# EAGLE schematic PCB - alu40 - mupusb (EAGLE 9.6.2)
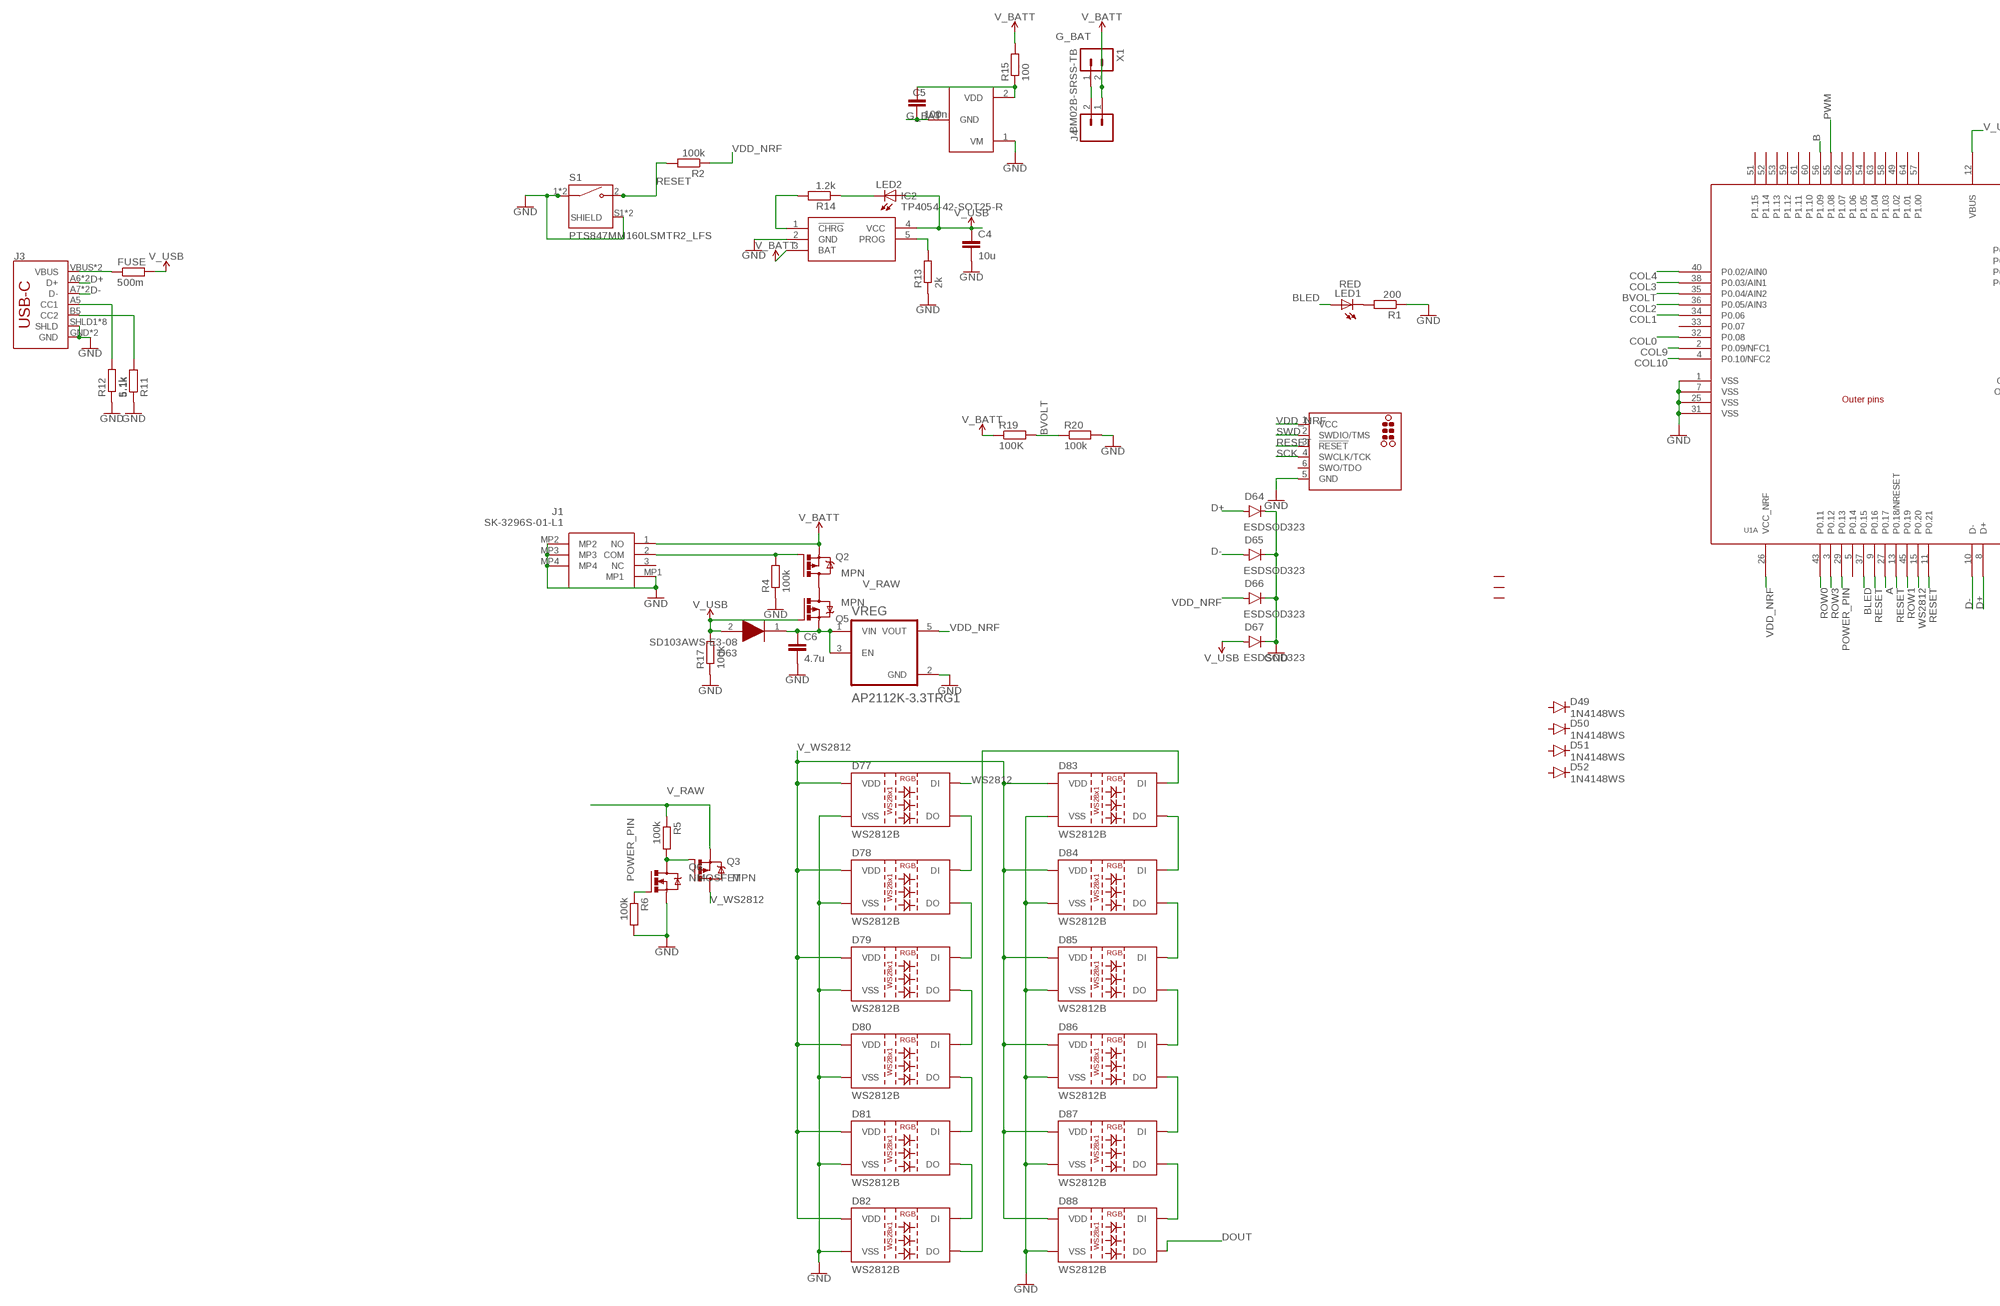
[diagram p0: schematic, sheet 1, part 1 of 2]
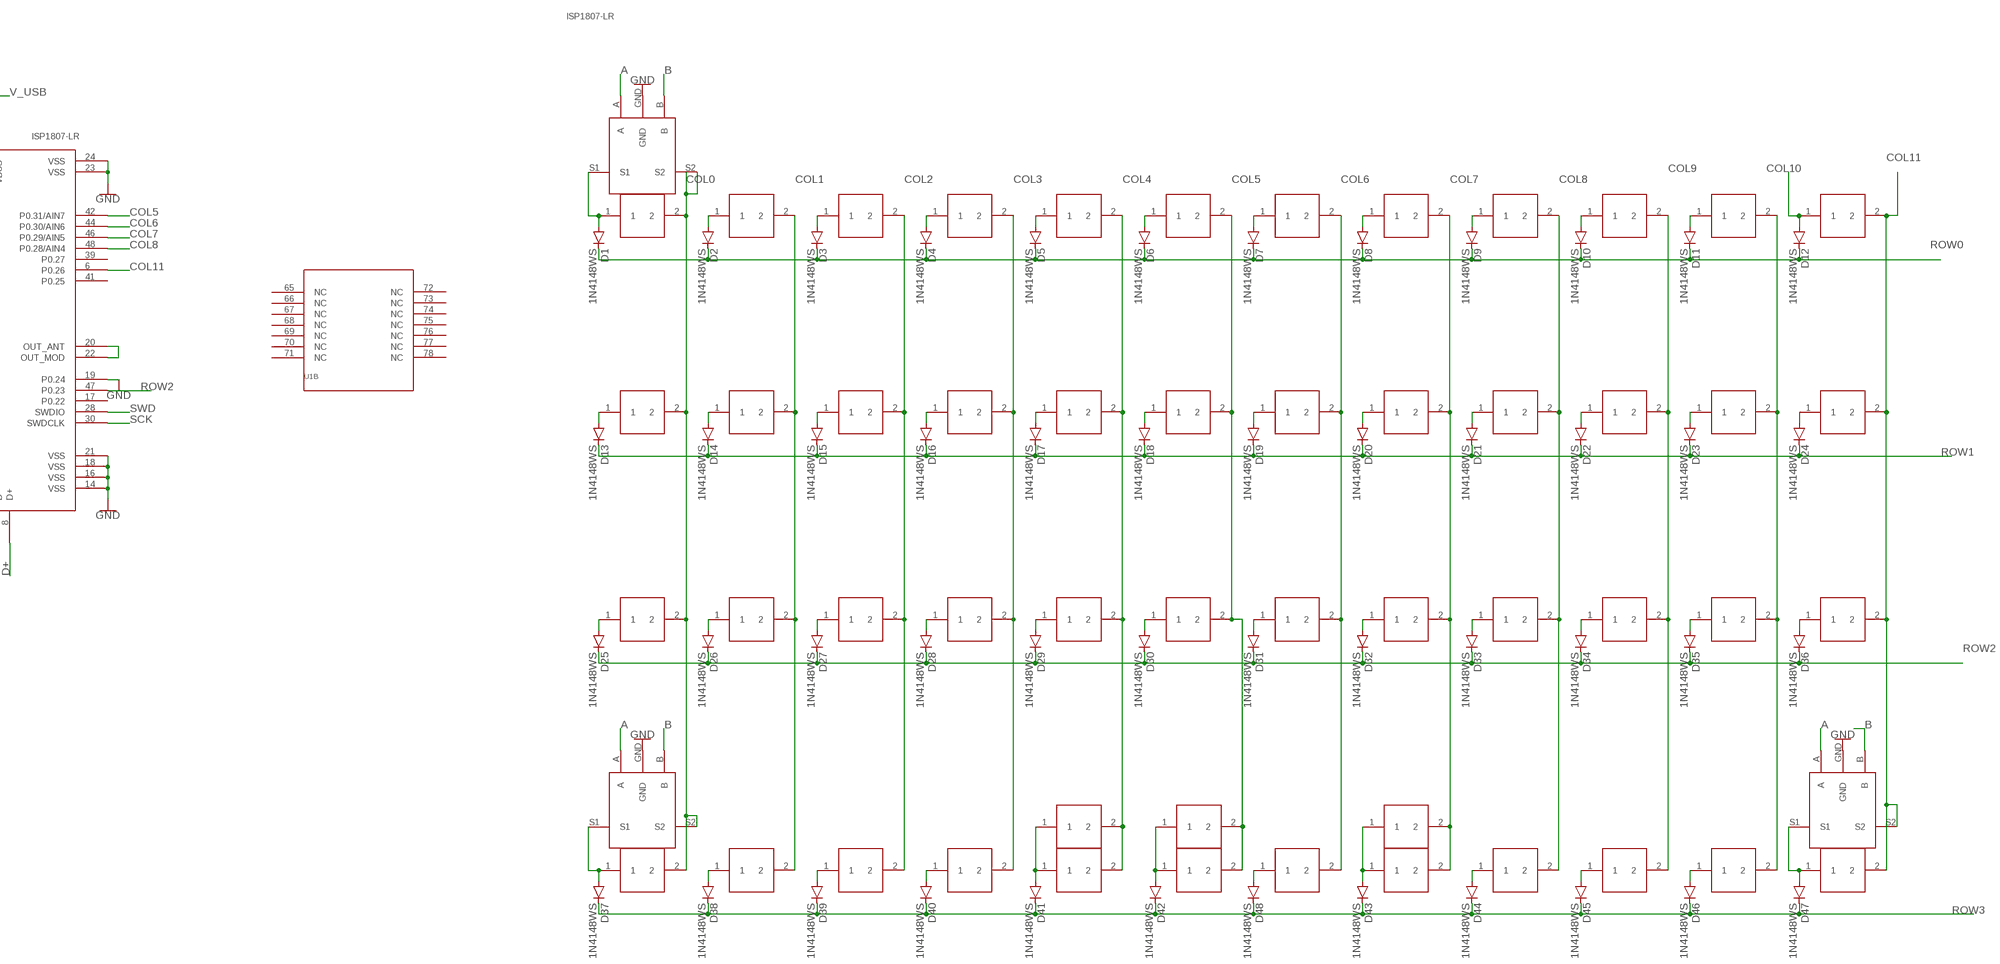
[diagram p1: schematic, sheet 1, part 2 of 2]

## Parts
11  CHERRY  [CHERRY]
11ENC  ENCODERHOLE  [ENCODER]
12  CHERRY  [CHERRY]
13  CHERRY  [CHERRY]
14  CHERRY  [CHERRY]
15  CHERRY  [CHERRY]
16  CHERRY  [CHERRY]
17  CHERRY  [CHERRY]
18  CHERRY  [CHERRY]
19  CHERRY  [CHERRY]
21  CHERRY  [CHERRY]
22  CHERRY  [CHERRY]
23  CHERRY  [CHERRY]
24  CHERRY  [CHERRY]
25  CHERRY  [CHERRY]
26  CHERRY  [CHERRY]
27  CHERRY  [CHERRY]
28  CHERRY  [CHERRY]
29  CHERRY  [CHERRY]
31  CHERRY  [CHERRY]
32  CHERRY  [CHERRY]
33  CHERRY  [CHERRY]
34  CHERRY  [CHERRY]
35  CHERRY  [CHERRY]
36  CHERRY  [CHERRY]
37  CHERRY  [CHERRY]
38  CHERRY  [CHERRY]
39  CHERRY  [CHERRY]
41  CHERRY  [CHERRY]
41ENC\  ENCODERHOLE  [ENCODER]
42  CHERRY  [CHERRY]
43  CHERRY  [CHERRY]
44  CHERRY  [CHERRY]
45  CHERRY  [CHERRY]
45-2  CHERRY  [CHERRY]
46  CHERRY  [CHERRY]
46-2  CHERRY  [CHERRY]
47  CHERRY  [CHERRY]
48  CHERRY  [CHERRY]
48-2  CHERRY  [CHERRY]
49  CHERRY  [CHERRY]
110  CHERRY  [CHERRY]
111  CHERRY  [CHERRY]
112  CHERRY  [CHERRY]
210  CHERRY  [CHERRY]
211  CHERRY  [CHERRY]
212  CHERRY  [CHERRY]
310  CHERRY  [CHERRY]
311  CHERRY  [CHERRY]
312  CHERRY  [CHERRY]
410  CHERRY  [CHERRY]
411  CHERRY  [CHERRY]
412  CHERRY  [CHERRY]
412ENC  ENCODERHOLE  [ENCODER]
C4  10u  C-EUC0603  [C0603]
C5  100n  C-EUC0603  [C0603]
C6  4.7u  C-EUC0603  [C0603]
D1  1N4148WS  [SOD-323]
D2  1N4148WS  [SOD-323]
D3  1N4148WS  [SOD-323]
D4  1N4148WS  [SOD-323]
D5  1N4148WS  [SOD-323]
D6  1N4148WS  [SOD-323]
D7  1N4148WS  [SOD-323]
D8  1N4148WS  [SOD-323]
D9  1N4148WS  [SOD-323]
D10  1N4148WS  [SOD-323]
D11  1N4148WS  [SOD-323]
D12  1N4148WS  [SOD-323]
D13  1N4148WS  [SOD-323]
D14  1N4148WS  [SOD-323]
D15  1N4148WS  [SOD-323]
D16  1N4148WS  [SOD-323]
D17  1N4148WS  [SOD-323]
D18  1N4148WS  [SOD-323]
D19  1N4148WS  [SOD-323]
D20  1N4148WS  [SOD-323]
D21  1N4148WS  [SOD-323]
D22  1N4148WS  [SOD-323]
D23  1N4148WS  [SOD-323]
D24  1N4148WS  [SOD-323]
D25  1N4148WS  [SOD-323]
D26  1N4148WS  [SOD-323]
D27  1N4148WS  [SOD-323]
D28  1N4148WS  [SOD-323]
D29  1N4148WS  [SOD-323]
D30  1N4148WS  [SOD-323]
D31  1N4148WS  [SOD-323]
D32  1N4148WS  [SOD-323]
D33  1N4148WS  [SOD-323]
D34  1N4148WS  [SOD-323]
D35  1N4148WS  [SOD-323]
D36  1N4148WS  [SOD-323]
D37  1N4148WS  [SOD-323]
D38  1N4148WS  [SOD-323]
D39  1N4148WS  [SOD-323]
D40  1N4148WS  [SOD-323]
D41  1N4148WS  [SOD-323]
D42  1N4148WS  [SOD-323]
D43  1N4148WS  [SOD-323]
D44  1N4148WS  [SOD-323]
D45  1N4148WS  [SOD-323]
D46  1N4148WS  [SOD-323]
D47  1N4148WS  [SOD-323]
D48  1N4148WS  [SOD-323]
D49  1N4148WS  [SOD-323]
D50  1N4148WS  [SOD-323]
D51  1N4148WS  [SOD-323]
D52  1N4148WS  [SOD-323]
D63  SD103AWS-E3-08  [SOD2713X115N]
D64  ESDSOD323  [SOD-323]
D65  ESDSOD323  [SOD-323]
D66  ESDSOD323  [SOD-323]
D67  ESDSOD323  [SOD-323]
D77  WS2812B  [WS2812B]
D78  WS2812B  [WS2812B]
D79  WS2812B  [WS2812B]
D80  WS2812B  [WS2812B]
D81  WS2812B  [WS2812B]
D82  WS2812B  [WS2812B]
D83  WS2812B  [WS2812B]
D84  WS2812B  [WS2812B]
D85  WS2812B  [WS2812B]
D86  WS2812B  [WS2812B]
D87  WS2812B  [WS2812B]
D88  WS2812B  [WS2812B]
FUSE  500m  R-EU_R0603  [R0603]
IC1  XB3303ASOT23  [SOT23-3]
IC2  TP4054-42-SOT25-R  [SOT95P280X100-5N]
J1  SK-3296S-01-L1  [SK3296S01L1]
J2  TC2030_SWD-MCP-NL  [TC2030-MCP-NL]
J3  SPARKFUN-CONNECTORS_USB_C  [MUP-MIDMNT-SS]
J4  CONN_02  [1X02]
LED1  RED  LEDCHIPLED_0805  [CHIPLED_0805]
LED2  LEDCHIPLED_0805  [CHIPLED_0805]
Q2  PMOSFET  PMOSFET_SOT23  [SOT23]
Q3  PMOSFET  PMOSFET_SOT23  [SOT23]
Q5  PMOSFET  PMOSFET_SOT23  [SOT23]
Q6  NMOSFET  NMOSFETSOT23  [SOT23]
R1  200  R-EU_R0603  [R0603]
R2  100k  R-EU_R0603  [R0603]
R4  100k  R-EU_R0603  [R0603]
R5  100k  R-EU_R0603  [R0603]
R6  100k  R-EU_R0603  [R0603]
R11  5.1k  R-EU_R0603  [R0603]
R12  5.1k  R-EU_R0603  [R0603]
R13  2k  R-EU_R0603  [R0603]
R14  1.2k  R-EU_R0603  [R0603]
R15  100  R-EU_R0603  [R0603]
R17  100k  R-EU_R0603  [R0603]
R19  100K  R-EU_R0603  [R0603]
R20  100k  R-EU_R0603  [R0603]
S1  PTS847MM160LSMTR2_LFS  [SW_PTS847MM160LSMTR2_LFS]
U1  ISP1807-LRISP1807-LR_ISP1807-LR  [ISP1807-LR]
U$8  STAB-2U  [STAB-2U]
U$9  STAB-2U  [STAB-2U]
U$10  STAB-2U  [STAB-2U]
VREG  AP2112K-3.3TRG1  [SOT95P285X140-5N]
X1  BM02B-SRSS-TB  [BM02B-SRSS-TB]

## Nets
A: 11ENC.A 41ENC\.A 412ENC.A U1.27(A:P0.17)
B: 11ENC.B 41ENC\.B 412ENC.B U1.56(A:P1.09)
BLED: LED1.A U1.37(A:P0.15)
BVOLT: R19.2 R20.1 U1.35(A:P0.04/AIN2)
COL0: 11.2 11ENC.S2 21.2 31.2 41.2 41ENC\.S2 U1.32(A:P0.08)
COL1: 12.2 22.2 32.2 42.2 U1.34(A:P0.06)
COL2: 13.2 23.2 33.2 43.2 U1.36(A:P0.05/AIN3)
COL3: 14.2 24.2 34.2 44.2 U1.38(A:P0.03/AIN1)
COL4: 15.2 25.2 35.2 45-2.2 45.2 U1.40(A:P0.02/AIN0)
COL5: 16.2 26.2 36.2 46-2.2 46.2 U1.42(A:P0.31/AIN7)
COL6: 17.2 27.2 37.2 47.2 U1.44(A:P0.30/AIN6)
COL7: 18.2 28.2 38.2 48-2.2 48.2 U1.46(A:P0.29/AIN5)
COL8: 19.2 29.2 39.2 49.2 U1.48(A:P0.28/AIN4)
COL9: 110.2 210.2 310.2 410.2 U1.2(A:P0.09/NFC1)
COL10: 111.2 211.2 311.2 411.2 U1.4(A:P0.10/NFC2)
COL11: 112.2 212.2 312.2 412.2 412ENC.S2 U1.6(A:P0.26)
D+: D64.A J3.A6(D+) J3.B6(D+) U1.8(A:D+)
D-: D65.A J3.A7(D-) J3.B7(D-) U1.10(A:D-)
DOUT: D88.2(DO)
G_BAT: C5.2 IC1.3(GND) J4.2 X1.1
GND: 11ENC.GND 41ENC\.GND 412ENC.GND C4.2 C6.2 D64.C D65.C D66.C D67.C D77.3(VSS) D78.3(VSS) D79.3(VSS) D80.3(VSS) D81.3(VSS) D82.3(VSS) D83.3(VSS) D84.3(VSS) D85.3(VSS) D86.3(VSS) D87.3(VSS) D88.3(VSS) IC1.1(VM) IC2.2(GND) J1.MP1 J1.MP2 J1.MP3 J1.MP4 J2.5(GND) J3.GND J3.GND2(GND) J3.SHLD1(SHLD) J3.SHLD2(SHLD) J3.SHLD3(SHLD) J3.SHLD4(SHLD) J3.SHLD5(SHLD) J3.SHLD6(SHLD) J3.SHLD7(SHLD) J3.SHLD8(SHLD) Q6.2(S) R1.1 R4.1 R6.2 R11.1 R12.1 R13.1 R17.1 R20.2 S1.1(COM) S1.3(COM) S1.S1(SHIELD) S1.S2(SHIELD) U1.1(A:VSS) U1.7(A:VSS) U1.14(A:VSS) U1.16(A:VSS) U1.18(A:VSS) U1.19(A:P0.24) U1.21(A:VSS) U1.23(A:VSS) U1.24(A:VSS) U1.25(A:VSS) U1.31(A:VSS) VREG.2(GND)
N$1: 47.1 D48.A
N$2: 12.1 D2.A
N$3: 13.1 D3.A
N$4: 14.1 D4.A
N$5: 15.1 D5.A
N$6: 16.1 D6.A
N$7: 17.1 D7.A
N$8: 18.1 D8.A
N$9: 19.1 D9.A
N$10: 110.1 D10.A
N$11: 111.1 D11.A
N$12: 112.1 D12.A
N$13: 21.1 D13.A
N$14: 22.1 D14.A
N$15: 23.1 D15.A
N$16: 24.1 D16.A
N$17: 25.1 D17.A
N$18: 26.1 D18.A
N$19: 27.1 D19.A
N$20: 28.1 D20.A
N$21: 29.1 D21.A
N$22: 210.1 D22.A
N$23: 211.1 D23.A
N$24: 212.1 D24.A
N$25: 31.1 D25.A
N$26: 32.1 D26.A
N$27: 33.1 D27.A
N$28: 34.1 D28.A
N$29: 35.1 D29.A
N$30: 36.1 D30.A
N$31: 37.1 D31.A
N$32: 38.1 D32.A
N$33: 39.1 D33.A
N$34: 310.1 D34.A
N$35: 311.1 D35.A
N$36: 312.1 D36.A
N$37: D77.2(DO) D78.4(DI)
N$38: 42.1 D38.A
N$39: 43.1 D39.A
N$40: 44.1 D40.A
N$41: 45-2.1 45.1 D41.A
N$42: U1.20(A:OUT_ANT) U1.22(A:OUT_MOD)
N$43: 48-2.1 48.1 D43.A
N$44: 49.1 D44.A
N$45: 410.1 D45.A
N$46: 411.1 D46.A
N$47: 46-2.1 46.1 D42.A
N$48: 412.1 412ENC.S1 D47.A
N$49: 41.1 41ENC\.S1 D37.A
N$50: LED1.C R1.2
N$52: C5.1 IC1.2(VDD) R15.1
N$53: IC2.5(PROG) R13.2
N$54: J3.A5(CC1) R12.2
N$55: J3.B5(CC2) R11.2
N$59: IC2.1(!CHRG) R14.2
N$60: LED2.C R14.1
N$61: Q2.3(D) Q5.3(D)
N$67: FUSE.1 J3.VBUS J3.VBUS2(VBUS)
N$68: 11.1 11ENC.S1 D1.A
N$75: J1.2(COM) Q2.1(G) R4.2
N$76: Q3.1(G) Q6.3(D) R5.2
N$79: D78.2(DO) D79.4(DI)
N$80: D79.2(DO) D80.4(DI)
N$81: D80.2(DO) D81.4(DI)
N$84: D81.2(DO) D82.4(DI)
N$85: D82.2(DO) D83.4(DI)
N$86: D83.2(DO) D84.4(DI)
N$87: D84.2(DO) D85.4(DI)
N$89: D85.2(DO) D86.4(DI)
N$90: D86.2(DO) D87.4(DI)
N$91: D87.2(DO) D88.4(DI)
POWER_PIN: Q6.1(G) R6.1 U1.29(A:P0.13)
PWM: U1.55(A:P1.08)
RESET: J2.3(!RESET) R2.2 S1.2(NO) U1.9(A:P0.16) U1.11(A:P0.21) U1.13(A:P0.18/NRESET)
ROW0: D1.C D2.C D3.C D4.C D5.C D6.C D7.C D8.C D9.C D10.C D11.C D12.C U1.43(A:P0.11)
ROW1: D13.C D14.C D15.C D16.C D17.C D18.C D19.C D20.C D21.C D22.C D23.C D24.C U1.45(A:P0.19)
ROW2: D25.C D26.C D27.C D28.C D29.C D30.C D31.C D32.C D33.C D34.C D35.C D36.C U1.47(A:P0.23)
ROW3: D37.C D38.C D39.C D40.C D41.C D42.C D43.C D44.C D45.C D46.C D47.C D48.C U1.3(A:P0.12)
SCK: J2.4(SWCLK/TCK) U1.30(A:SWDCLK)
SWD: J2.2(SWDIO/TMS) U1.28(A:SWDIO)
V_BATT: IC2.3(BAT) J1.1(NO) J4.1 Q2.2(S) R15.2 R19.1 X1.2
V_RAW: C6.1 D63.1(K) Q3.2(S) Q5.2(S) R5.1 VREG.1(VIN) VREG.3(EN)
V_USB: C4.1 D63.2(A) D67.A FUSE.2 IC2.4(VCC) LED2.A Q5.1(G) R17.2 U1.12(A:VBUS)
V_WS2812: D77.1(VDD) D78.1(VDD) D79.1(VDD) D80.1(VDD) D81.1(VDD) D82.1(VDD) D83.1(VDD) D84.1(VDD) D85.1(VDD) D86.1(VDD) D87.1(VDD) D88.1(VDD) Q3.3(D)
VDD_NRF: D66.A J2.1(VCC) R2.1 U1.26(A:VCC_NRF) VREG.5(VOUT)
WS2812: D77.4(DI) U1.15(A:P0.20)
Unconnected: D49.A D49.C D50.A D50.C D51.A D51.C D52.A D52.C J1.3(NC) J2.6(SWO/TDO) U1.5(A:P0.14) U1.17(A:P0.22) U1.33(A:P0.07) U1.39(A:P0.27) U1.41(A:P0.25) U1.49(A:P1.02) U1.50(A:P1.06) U1.51(A:P1.15) U1.52(A:P1.14) U1.53(A:P1.13) U1.54(A:P1.05) U1.57(A:P1.00) U1.58(A:P1.03) U1.59(A:P1.12) U1.60(A:P1.10) U1.61(A:P1.11) U1.62(A:P1.07) U1.63(A:P1.04) U1.64(A:P1.01) U1.65(B:NC) U1.66(B:NC) U1.67(B:NC) U1.68(B:NC) U1.69(B:NC) U1.70(B:NC) U1.71(B:NC) U1.72(B:NC) U1.73(B:NC) U1.74(B:NC) U1.75(B:NC) U1.76(B:NC) U1.77(B:NC) U1.78(B:NC)

## Library data of the parts
11-19 21-29 31-39 41-45 45-2 46 46-2 47 48 48-2 49 110-112 210-212 310-312 410-412 = Volume_V1:CHERRY
11ENC 41ENC\ 412ENC = Volume_V1:ENCODER
C4 C5 = resistor:C-EU: CAPACITOR, European symbol
C6 = Volume_V1:C-EU: CAPACITOR, European symbol; SPICEPREFIX: C
D1-D52 = Volume_V1:1N4148WS: DIODE GEN PURP 75V 150MA SOD323F Manufacturer's datasheet <https://www.onsemi.com/pub/Collateral/1N914BWS-D.pdf>; CREATED_BY: PCBLayout.com; DIGIKEY_PART_NUMBER: 1N4148WSFSTR-ND; MANUFACTURER: Diodes Incorporated; MPN: 1N4148WS; PACKAGE: SOD-323
D63 = Volume_V1:SD103AWS-E3-08: Vishay SD103AWS-E3-08, SMT Schottky Diode, 40V 350mA, 10ns, 2-Pin SOD-323 Source: Datasheet <http://www.vishay.com/docs/85682/sd103aws.pdf>; ARROW_PART_NUMBER: SD103AWS-E3-08; ARROW_PRICE-STOCK: https://www.arrow.com/en/products/sd103aws-e3-08/vishay; DESCRIPTION: Vishay SD103AWS-E3-08, SMT Schottky Diode, 40V 350mA, 10ns, 2-Pin SOD-323; HEIGHT: 1.15mm; MANUFACTURER_NAME: Vishay; MANUFACTURER_PART_NUMBER: SD103AWS-E3-08; MOUSER_PART_NUMBER: 78-SD103AWS-E3-08; MOUSER_PRICE-STOCK: https://www.mouser.co.uk/ProductDetail/Vishay-Semiconductors/SD103AWS-E3-08?qs=S660mHfF5o1xcba7ic5A%252BA%3D%3D
D64-D67 = Volume_V1:ESDSOD323: DIODE GEN PURP 75V 150MA SOD323F Manufacturer's datasheet <https://www.onsemi.com/pub/Collateral/1N914BWS-D.pdf>; CREATED_BY: PCBLayout.com; MANUFACTURER: Diodes Incorporated; PACKAGE: SOD-323
D77-D88 = Volume_V1:WS2812B: WS2812B SMD addressable RGB LED 5x5mm SMD LED with built-in controller IC. Color: Red/Green/Blue mC Rating: RGB: 390, 660, 180 mcd Forward Voltage: RGB: 2.0, 3.0, 3.0 V Packages:WS2812B SparkFun Products: Blynk Board - ESP8266 <https://www.sparkfun.com/products/13794>; PROD_ID: DIO-12503
FUSE R1 R2 R11-R15 R19 R20 = rcl:R-EU_: RESISTOR, European symbol; SPICEPREFIX: R
IC1 = Volume_V1:XB3303A
IC2 = TP4054-42-SOT25-R:TP4054-42-SOT25-R: Standalone Linear Li-ion Battery Charger with Thermal Regulation, SOT-23-5 Source: Datasheet <http://images.100y.com.tw/pdf_file/38-TP-TP4054x.pdf>; DESCRIPTION: Standalone Linear Li-ion Battery Charger with Thermal Regulation, SOT-23-5; HEIGHT: 1mm; MANUFACTURER_NAME: TOP POWER; MANUFACTURER_PART_NUMBER: TP4054-42-SOT25-R
J1 = Volume_V1:SK-3296S-01-L1: Toggle Switches SMD RoHS Source: Datasheet <https://datasheet.lcsc.com/szlcsc/XKB-SK-3296S-01-L1_C319020.pdf>; DESCRIPTION: Toggle Switches SMD RoHS; HEIGHT: 1.4mm; MANUFACTURER_NAME: XKB Enterprise; MANUFACTURER_PART_NUMBER: SK-3296S-01-L1
J2 = tag-connect:TC2030_SWD: ARM20-CTX 20-Pin to TC2030-IDC Adapter for Cortex 6-Pin (TC2030-IDC family) </catalog/6> Cortex SWD </catalog/9> Adapters </adaptors> <javascript:void(0);> The Tag-Connect ARM20-CTX adapter board allows our TC2030-IDC cables to be used for ARM SWD (Single Wire Debug) applications. Although intended for use with our patented TC2030-IDC (and TC2030-IDC-NL) Plug-of-Nails™ Cables, the adapter may be useful to people wishing to use 6-pin 0.1” ribbon headers on their PCB instead of the traditional 20-Pin header. Please note the TC2030-IDC <http://tag-connect.com/TC2030-IDC> or TC2030-IDC-NL <http://tag-connect.com/TC2030-IDC-NL> cable is purchased separately, the cables and Segger JLINK seen in the pictures are not included! Download the Datasheet here. <http://www.tag-connect.com/Materials/ARM20-CTX.pdf>
J3 = Volume_V1:SPARKFUN-CONNECTORS_USB_C: USB Type C 16Pin Connector Super Speed pins not available on the 16-pin purely SMD connector so this part is best for USB 2.0 implementations. D1 and D2 are tied together enabling D+/- no matter which way the cable is plugged into the connector. The two channel configuration pins (CC1/2) are exposed. These are normally connected to ground via 5.1k resistors but can be reconfigured for high current/high power applications.
J4 = SparkFun-Connectors:CONN_02: Multi connection point. Often used as Generic Header-pin footprint for 0.1 inch spaced/style header connections On any of the 0.1 inch spaced packages, you can populate with these: Break Away Headers - Straight <https://www.sparkfun.com/products/116> (PRT-00116) Break Away Male Headers - Right Angle <https://www.sparkfun.com/products/553> (PRT-00553) Female Headers <https://www.sparkfun.com/products/115> (PRT-00115) Break Away Headers - Machine Pin <https://www.sparkfun.com/products/117> (PRT-00117) Break Away Female Headers - Swiss Machine Pin <https://www.sparkfun.com/products/743> (PRT-00743) For SCREWTERMINALS and SPRING TERMINALS visit here: Screw Terimnals on SparkFun.com <https://www.sparkfun.com/search/results?term=Screw+Terminals> (5mm/3.5mm/2.54mm spacing) This device is also useful as a general connection point to wire up your design to another part of your project. Our various solder wires solder well into these plated through hole pads. Hook-Up Wire - Assortment (Stranded, 22 AWG) <https://www.sparkfun.com/products/11375> (PRT-11375) Hook-Up Wire - Assortment (Solid Core, 22 AWG) <https://www.sparkfun.com/products/11367> (PRT-11367) View the entire wire category on our website here <https://www.sparkfun.com/categories/141> Special notes: Molex polarized connector foot print use with: PRT-08233 with associated crimp pins and housings. 2.54_SCREWTERM for use with PRT-10571. 3.5mm Screw Terminal footprints for PRT-08084 5mm Screw Terminal footprints for use with PRT-08432
LED1 LED2 = adafruit:LED: LED OSRAM: - CHIPLED LG R971, LG N971, LY N971, LG Q971, LY Q971, LO R971, LY R971 LH N974, LH R974 LS Q976, LO Q976, LY Q976 LO Q996 - Hyper CHIPLED LW Q18S LB Q993, LB Q99A, LB R99A - SideLED LS A670, LO A670, LY A670, LG A670, LP A670 LB A673, LV A673, LT A673, LW A673 LH A674 LY A675 LS A676, LA A676, LO A676, LY A676, LW A676 LS A679, LY A679, LG A679 - Hyper Micro SIDELED® LS Y876, LA Y876, LO Y876, LY Y876 LT Y87S - SmartLED LW L88C, LW L88S LB L89C, LB L89S, LG L890 LS L89K, LO L89K, LY L89K LS L896, LA L896, LO L896, LY L896 - TOPLED LS T670, LO T670, LY T670, LG T670, LP T670 LSG T670, LSP T670, LSY T670, LOP T670, LYG T670 LG T671, LOG T671, LSG T671 LB T673, LV T673, LT T673, LW T673 LH T674 LS T676, LA T676, LO T676, LY T676, LB T676, LH T676, LSB T676, LW T676 LB T67C, LV T67C, LT T67C, LS T67K, LO T67K, LY T67K, LW E67C LS E67B, LA E67B, LO E67B, LY E67B, LB E67C, LV E67C, LT E67C LW T67C LS T679, LY T679, LG T679 LS T770, LO T770, LY T770, LG T770, LP T770 LB T773, LV T773, LT T773, LW T773 LH T774 LS E675, LA E675, LY E675, LS T675 LS T776, LA T776, LO T776, LY T776, LB T776 LHGB T686 LT T68C, LB T68C - Hyper Mini TOPLED® LB M676 - Mini TOPLED Santana® LG M470 LS M47K, LO M47K, LY M47K Source: http://www.osram.convergy.de/
Q2 Q3 Q5 = Transistor:PMOSFET: P-Channel MOSFET - Generic; CATEGORY: Transistor; MPN: SL2301S; SUB-CATEGORY: MOSFET; TYPE: P-Channel
Q6 = Transistor:NMOSFET: N-Channel MOSFET - Generic; CATEGORY: Transistor; SUB-CATEGORY: MOSFET; TYPE: N-Channel
R4-R6 R17 = Volume_V1:R-EU_: RESISTOR, European symbol; SPICEPREFIX: R
S1 = PTS847MM160LSMTR2_LFS:PTS847MM160LSMTR2_LFS: Tactile Switch SPST-NO Side Actuated Edge Mount, Right Angle Check availability <https://pricing.snapeda.com/parts/PTS847MM160LSMTR2%20LFS/C%26K/view-part?ref=eda>; AVAILABILITY: In Stock; CHECK_PRICES: https://www.snapeda.com/parts/PTS847MM160LSMTR2%20LFS/C%2526K/view-part/?ref=eda; DESCRIPTION: Tactile Switch SPST-NO Side Actuated Edge Mount, Right Angle; MF: C&K; MP: PTS847MM160LSMTR2 LFS; PACKAGE: None; PRICE: None; SNAPEDA_LINK: https://www.snapeda.com/parts/PTS847MM160LSMTR2%20LFS/C%2526K/view-part/?ref=snap
U1 = ISP1807LR_Int:ISP1807-LR: ISP Smart Bluetooth Module; BOI: QFN 8 x 8; BOI-METRIC: QFN 8 x 8; DESIG: BLE Module; FAB: Insight SiP; ISP_PART: ISP1807; REF: ISP1807-LR
U$8-U$10 = Volume_V1:STAB-2U
VREG = Volume_V1:AP2112K-3.3TRG1: AP2112 Series 0.6 A 3.3 V Fixed Output SMT LDO Linear Regulator - SOT23-5 Check prices <https://pricing.snapeda.com/parts/AP2112K-3.3TRG1/Diodes%20Inc./view-part?ref=eda>; AVAILABILITY: Good; DESCRIPTION: Linear Voltage Regulator IC 1 Output 600mA SOT-25; MF: Diodes Inc.; MP: AP2112K-3.3TRG1; PACKAGE: SOT-753 Diodes Inc.; PRICE: None; PURCHASE-URL: https://pricing.snapeda.com/search/part/AP2112K-3.3TRG1/?ref=eda
X1 = Volume_V1:BM02B-SRSS: JST SH series header 1.00mm pitch disconnectable crimp style connectors, vertical (side entry type), 2 pins